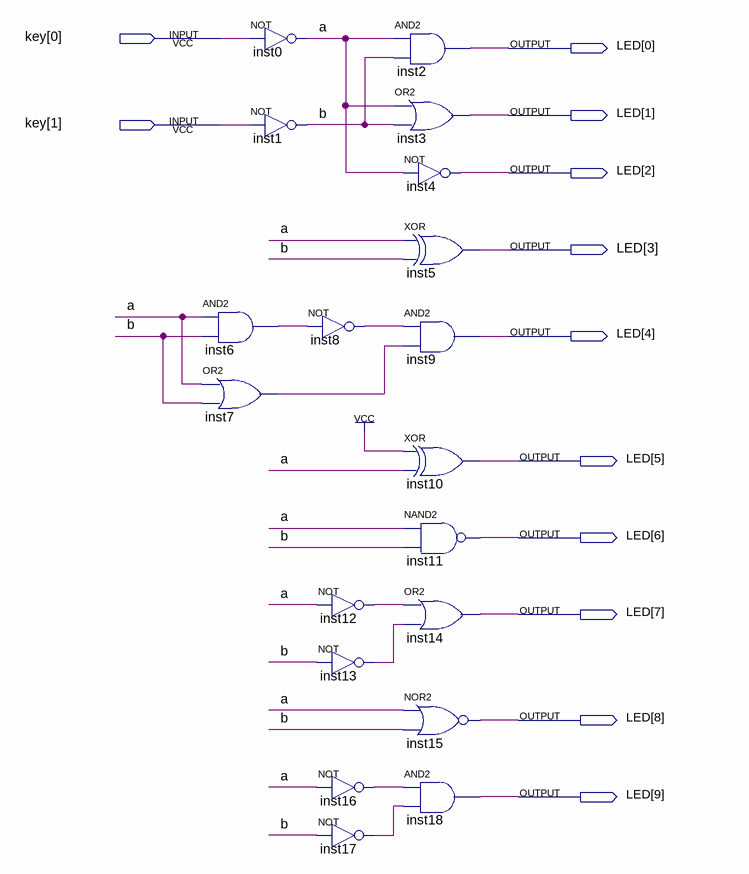
[diagram p0: schematic sheet]
// Quartus schematic lab1.bdf as structural Verilog: 19 symbols, 12 pins
module lab1 (
  input  [1:0] key,
  output [9:0] LED
);

  wire a, b, inst6_out, inst7_out, inst8_out, inst12_out, inst13_out, inst16_out, inst17_out;

  not inst0 (a, key[0]);
  not inst1 (b, key[1]);
  and inst6 (inst6_out, a, b);
  or inst7 (inst7_out, a, b);
  not inst8 (inst8_out, inst6_out);
  not inst12 (inst12_out, a);
  not inst13 (inst13_out, b);
  not inst16 (inst16_out, a);
  not inst17 (inst17_out, b);
  and inst2 (LED[0], a, b);
  or inst3 (LED[1], a, b);
  not inst4 (LED[2], a);
  xor inst5 (LED[3], a, b);
  and inst9 (LED[4], inst8_out, inst7_out);
  xor inst10 (LED[5], 1'b1, a);
  nand inst11 (LED[6], a, b);
  or inst14 (LED[7], inst12_out, inst13_out);
  nor inst15 (LED[8], a, b);
  and inst18 (LED[9], inst16_out, inst17_out);
endmodule
